# EAGLE schematic MRCS-Tiny85-Servo-Auto (EAGLE 7.7.0)
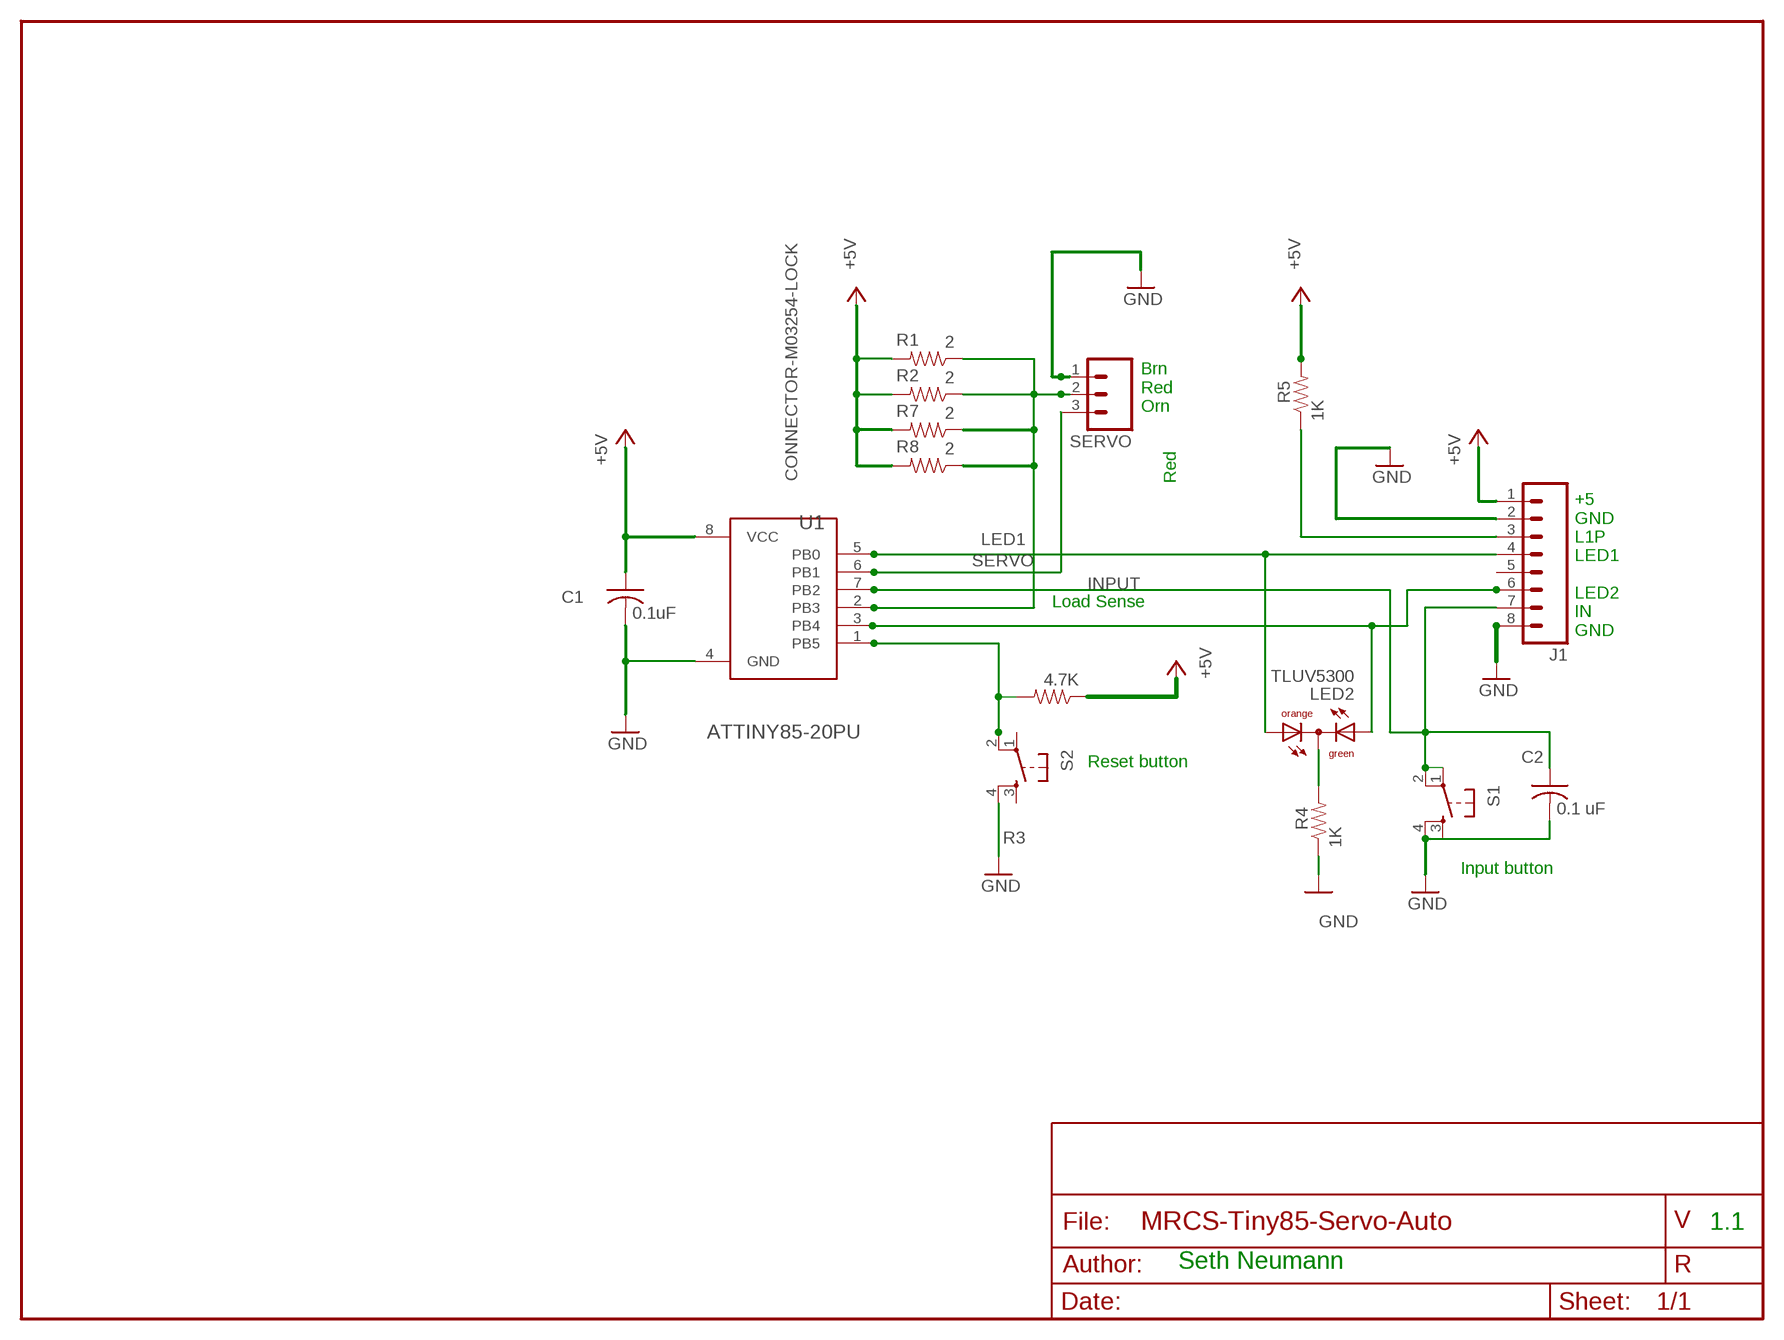
[diagram p0: schematic, sheet 1]

## Parts
C1  0.1uF  CAPPTH2  [C-PTH-0.100]
C2  0.1 uF  CAPPTH2  [C-PTH-0.100]
J1  CONNECTOR-M08LOCK  [1X08_LOCK]
LED2  TLUV5300  [TLUV5300]
R1  2  RPTH04  [AXIAL-0.4-RES]
R2  2  RPTH04  [AXIAL-0.4-RES]
R3  4.7K  RPTH04  [AXIAL-0.4-RES]
R4  1K  RPTH04  [AXIAL-0.4-RES]
R5  1K  RPTH04  [AXIAL-0.4-RES]
R7  2  RPTH04  [AXIAL-0.4-RES]
R8  2  RPTH04  [AXIAL-0.4-RES]
S1  TAC_SWITCHPTH  [TACTILE-PTH]
S2  TAC_SWITCHPTH  [TACTILE-PTH]
SERVO  CONNECTOR-M03254-LOCK  [3POL254]
U1  ATTINY85-20PU  [DIP762W46P254L927H533Q8B]

## Nets
+5V: C1.1 J1.1 R1.P$2 R2.P$2 R3.P$1 R5.P$2 R7.P$2 R8.P$2 U1.8(VCC)
ADC3: R1.P$1 R2.P$1 R7.P$1 R8.P$1 SERVO.2 U1.2(PB3)
GND: C1.2 C2.2 J1.2 J1.8 R4.P$1 S1.3 S1.4 S2.4 SERVO.1 U1.4(GND)
INPUT: C2.1 J1.7 S1.1 S1.2 U1.7(PB2)
LED1: J1.4 LED2.AO U1.5(PB0)
LED1PWR: J1.3 R5.P$1
N$1: LED2.CC R4.P$2
N$3: R3.P$2 S2.2 U1.1(PB5)
N$4: J1.6 LED2.AG U1.3(PB4)
SERVO: SERVO.3 U1.6(PB1)
Unconnected: J1.5 S2.1 S2.3

## Notes on the sheet
- Brn
  Red
  Orn
- Red
- Load Sense
- +5
  GND
  L1P
  LED1
  
  LED2
  IN
  GND
- Reset button
- Input button
- 1.1
- Seth Neumann

## Library data of the parts
C1 C2 = SPCoast:CAP*
J1 = SPCoast:CONNECTOR-M08: Header 8 Standard 8-pin 0.1" header. Use with straight break away headers (SKU : PRT-00116), right angle break away headers (PRT-00553), swiss pins (PRT-00743), machine pins (PRT-00117), and female headers (PRT-00115).
LED2 = led:TLUV5300: Bicolor LED 5 mm Untinted Diffused Package Source: www.vishay.com .. Bi-Color LED Vashay TLUV5300.pdf
R1-R5 R7 R8 = SPCoast:R*: Resistor Basic schematic elements and footprints for 0603, 1206, and PTH 1/10th watt (small) resistors.
S1 S2 = SparkFun-Electromechanical:TAC_SWITCH: Momentary Switch Button commonly used for reset or general input. Spark Fun Electronics SKU : COM-00097 SMT- SWCH-08247
SERVO = SPCoast:CONNECTOR-M03
U1 = ATTINY85-20PU:ATTINY85-20PU: ATtiny Series 20 MHz 8 KB Flash 512 B SRAM 8-Bit Microcontroller - DIP-8 Check availability <https://pricing.snapeda.com/parts/ATTINY85-20PU/Microchip%20Technology%20/%20Atmel/view-part?ref=eda>; AVAILABILITY: In Stock; DESCRIPTION: AVR AVR® ATtiny, Functional Safety (FuSa) Microcontroller IC 8-Bit 20MHz 8KB (4K x 16) FLASH 8-PDIP; MF: Microchip Technology / Atmel; MP: ATTINY85-20PU; PACKAGE: None; PRICE: None; PURCHASE-URL: https://pricing.snapeda.com/search/part/ATTINY85-20PU/?ref=eda